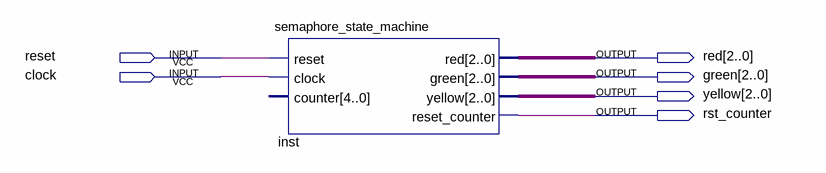
[diagram p0: schematic sheet]
// Quartus schematic semaphore.bdf as structural Verilog: 1 symbols, 6 pins
module semaphore (
  input  reset,
  input  clock,
  output [2:0] red,
  output [2:0] green,
  output [2:0] yellow,
  output rst_counter
);

  semaphore_state_machine inst (
    .reset(reset), .clock(clock), .red(red), .green(green), .yellow(yellow), .reset_counter(rst_counter));  // open: counter
endmodule
